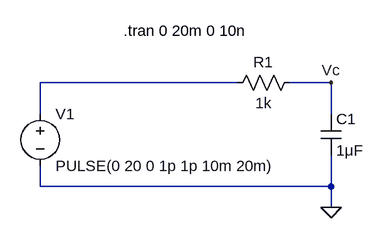
[diagram p0: schematic sim_1.asc]
sim_1.asc, the LTspice schematic file:
Version 4
SHEET 1 880 680
WIRE 144 128 -160 128
WIRE 288 128 224 128
WIRE -160 176 -160 128
WIRE 288 176 288 128
WIRE -160 288 -160 256
WIRE 288 288 288 240
WIRE 288 288 -160 288
WIRE 288 320 288 288
FLAG 288 320 0
FLAG 288 128 Vc
SYMBOL res 240 112 R90
WINDOW 0 0 56 VBottom 2
WINDOW 3 32 56 VTop 2
SYMATTR InstName R1
SYMATTR Value 1k
SYMATTR SpiceLine tol=1 pwr=0.1
SYMBOL cap 272 176 R0
SYMATTR InstName C1
SYMATTR Value 1μF
SYMBOL voltage -160 160 R0
WINDOW 123 0 0 Left 0
WINDOW 39 0 0 Left 0
SYMATTR InstName V1
SYMATTR Value PULSE(0 20 0 1p 1p 10m 20m)
TEXT -32 48 Left 2 !.tran 0 20m 0 10n

The netlist it stands for:
* sim_1.asc
R1 Vc N001 1k tol=1 pwr=0.1
C1 Vc 0 1μF
V1 N001 0 PULSE(0 20 0 1p 1p 10m 20m)
.tran 0 20m 0 10n
.backanno
.end

* Results of the author's LTspice run, read from the files saved beside the schematic
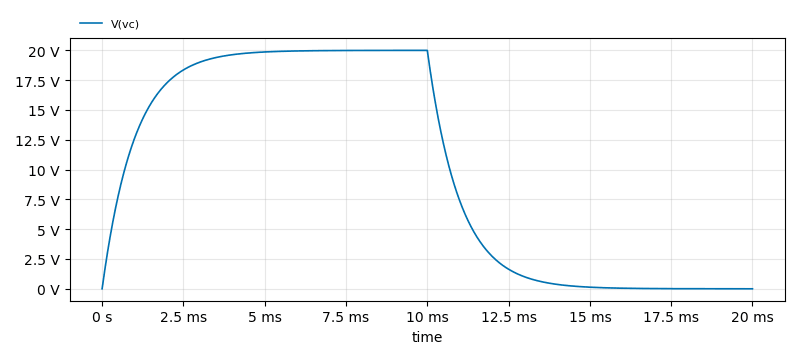
[diagram p1: Transient Analysis of sim_1.asc, plotted from the saved traces]
* Transient Analysis, 1 run:
*   V(vc): min 0 V, max 20 V, average 10 V, rms 13.42 V, last 908 µV